# Altium schematic sheet SENSORS.SchDoc
size A
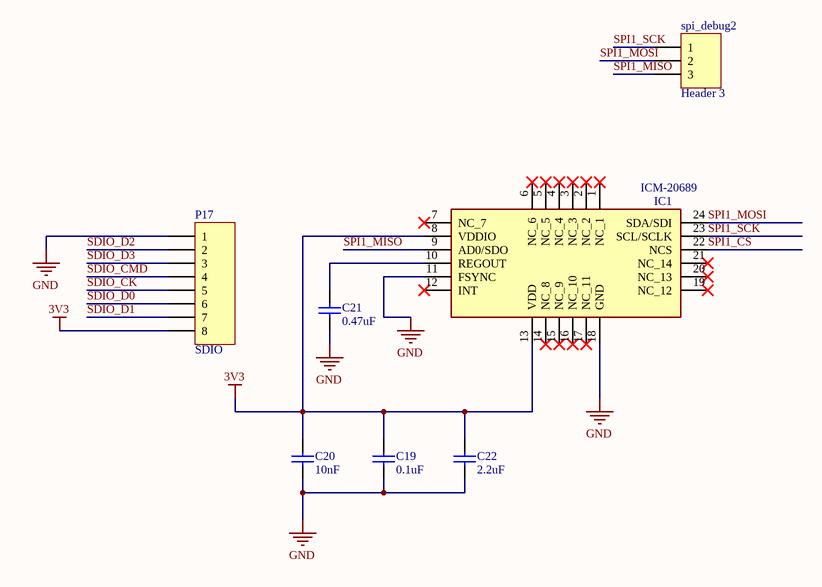
[diagram p0: SENSORS.SchDoc]

## Parts
C19  0.1uF  [CAPC2012X145N]
C20  10nF  [CAPC2012X145N]
C21  0.47uF  [CAPC1608X90N]
C22  2.2uF  [CAPC3216X125N]
IC1  ICM-20689  [ICM20689]
P17  SDIO  [HDR1X8]
spi_debug2  Header 3  [HDR1X3]

## Nets
3V3: C19.1 C20.1 C22.2 IC1.8(VDDIO) IC1.13(VDD) P17.8
GND: C19.2 C20.2 C21.1 C22.1 IC1.11(FSYNC) IC1.18(GND) P17.1
SDIO_CK: P17.5
SDIO_CMD: P17.4
SDIO_D0: P17.6
SDIO_D1: P17.7
SDIO_D2: P17.2
SDIO_D3: P17.3
SPI1_CS: IC1.22(NCS)
SPI1_MISO: IC1.9(AD0/SDO) spi_debug2.3
SPI1_MOSI: IC1.24(SDA/SDI) spi_debug2.2
SPI1_SCK: IC1.23(SCL/SCLK) spi_debug2.1
NetC21_2: C21.2 IC1.10(REGOUT)

Not connected (* = marked no-connect by the designer): IC1 1(NC_1)* 2(NC_2)* 3(NC_3)* 4(NC_4)* 5(NC_5)* 6(NC_6)* 7(NC_7)* 12(INT)* 14(NC_8)* 15(NC_9)* 16(NC_10)* 17(NC_11)* 19(NC_12)* 20(NC_13)* 21(NC_14)*

## Library data of the parts
C19 C21 C22 = Cap Semi: Capacitor (Semiconductor SIM Model); Value: 104; LatestRevisionDate: 17-Jul-2002; LatestRevisionNote: Re-released for DXP Platform.; PackageReference: C1206; Publisher: Altium Limited
C20 = Cap Semi: Capacitor (Semiconductor SIM Model); Value: 104; Component Code: VJ0805Y103KNAAO; LatestRevisionDate: 17-Jul-2002; LatestRevisionNote: Re-released for DXP Platform.; PackageReference: C1206; Publisher: Altium Limited
IC1 = ICM-20689: Integrated Circuit; Manufacturer_Name: InvenSense Inc.; Datasheet Link: http://www.invensense.com/wp-content/uploads/2017/08/ICM-20689-v2.2-002.pdf; Height: 1mm; Manufacturer_Part_Number: ICM-20689; Mouser Part Number: 410-ICM-20689; Mouser Price/Stock: https://www.mouser.com/Search/Refine.aspx?Keyword=410-ICM-20689
P17 = Header 8: Header, 8-Pin; LatestRevisionDate: 17-Jul-2002; LatestRevisionNote: Re-released for DXP Platform.; Publisher: Altium Limited
spi_debug2 = Header 3: Header, 3-Pin; LatestRevisionDate: 17-Jul-2002; LatestRevisionNote: Re-released for DXP Platform.; Publisher: Altium Limited